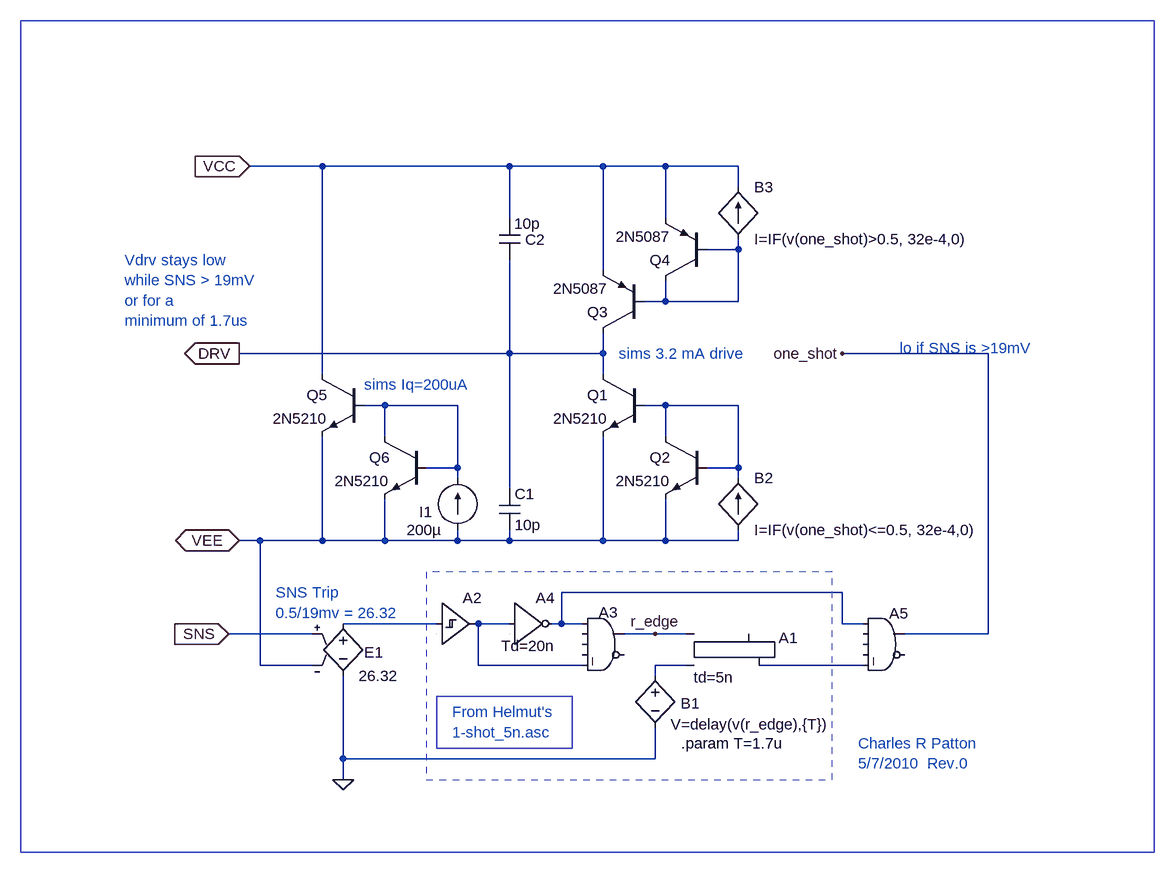
[diagram p0: schematic ZXSC300.asc]
ZXSC300.asc, the LTspice schematic file:
Version 4
SHEET 1 972 740
WIRE -336 -688 -448 -688
WIRE -48 -688 -336 -688
WIRE 96 -688 -48 -688
WIRE 192 -688 96 -688
WIRE 304 -688 192 -688
WIRE 304 -656 304 -688
WIRE -48 -608 -48 -688
WIRE 192 -608 192 -688
WIRE 304 -560 304 -576
WIRE 304 -560 256 -560
WIRE 96 -528 96 -688
WIRE 192 -480 192 -512
WIRE 192 -480 160 -480
WIRE 304 -480 304 -560
WIRE 304 -480 192 -480
WIRE -48 -400 -48 -544
WIRE -48 -400 -464 -400
WIRE 96 -400 96 -432
WIRE 96 -400 -48 -400
WIRE 688 -400 464 -400
WIRE -336 -368 -336 -688
WIRE 96 -368 96 -400
WIRE -240 -320 -272 -320
WIRE -128 -320 -240 -320
WIRE 192 -320 160 -320
WIRE 304 -320 192 -320
WIRE -240 -272 -240 -320
WIRE 192 -272 192 -320
WIRE -128 -224 -128 -320
WIRE -128 -224 -176 -224
WIRE 304 -224 304 -320
WIRE 304 -224 256 -224
WIRE -128 -208 -128 -224
WIRE 304 -208 304 -224
WIRE -48 -192 -48 -400
WIRE -432 -112 -464 -112
WIRE -336 -112 -336 -272
WIRE -336 -112 -432 -112
WIRE -240 -112 -240 -176
WIRE -240 -112 -336 -112
WIRE -128 -112 -128 -128
WIRE -128 -112 -240 -112
WIRE -48 -112 -48 -128
WIRE -48 -112 -128 -112
WIRE 96 -112 96 -272
WIRE 96 -112 -48 -112
WIRE 192 -112 192 -176
WIRE 192 -112 96 -112
WIRE 304 -112 304 -128
WIRE 304 -112 192 -112
WIRE 464 -32 32 -32
WIRE -160 16 -304 16
WIRE -48 16 -96 16
WIRE 32 16 32 -32
WIRE 32 16 16 16
WIRE 64 16 32 16
WIRE 464 16 464 -32
WIRE 496 16 464 16
WIRE -352 32 -480 32
WIRE 176 32 128 32
WIRE 224 32 176 32
WIRE 688 32 688 -400
WIRE 688 32 560 32
WIRE -432 80 -432 -112
WIRE -352 80 -432 80
WIRE -96 80 -96 16
WIRE 64 80 -96 80
WIRE 224 80 176 80
WIRE 496 80 336 80
WIRE 176 96 176 80
WIRE -304 224 -304 96
WIRE 176 224 176 176
WIRE 176 224 -304 224
WIRE -304 256 -304 224
FLAG -480 32 SNS
IOPIN -480 32 In
FLAG 176 32 r_edge
FLAG -464 -400 DRV
IOPIN -464 -400 Out
FLAG 464 -400 one_shot
FLAG -448 -688 VCC
IOPIN -448 -688 In
FLAG -464 -112 VEE
IOPIN -464 -112 BiDir
FLAG -304 256 0
SYMBOL Digital\\srflop 272 -16 R0
WINDOW 123 -37 115 Left 0
SYMATTR Value2 td=5n
SYMATTR InstName A1
SYMBOL bv 176 80 R0
WINDOW 0 39 59 Left 0
WINDOW 3 24 91 Left 0
SYMATTR InstName B1
SYMATTR Value V=delay(v(r_edge),{T})
SYMBOL Digital\\schmtbuf -160 -48 R0
SYMATTR InstName A2
SYMBOL e -304 0 R0
WINDOW 0 32 60 Left 0
SYMATTR InstName E1
SYMATTR Value 26.32
SYMBOL Digital\\and 96 -16 R0
WINDOW 0 -7 15 Left 0
SYMATTR InstName A3
SYMBOL Digital\\inv -48 -48 R0
WINDOW 3 -13 98 Left 0
SYMATTR Value Td=20n
SYMATTR InstName A4
SYMBOL Digital\\and 528 -16 R0
SYMATTR InstName A5
SYMBOL cap -64 -192 R0
SYMATTR InstName C1
SYMATTR Value 10p
SYMBOL bi2 304 -208 R0
SYMATTR Value I=IF(v(one_shot)<=0.5, 32e-4,0)
SYMATTR InstName B2
SYMBOL bi2 304 -656 R0
SYMATTR Value I=IF(v(one_shot)>0.5, 32e-4,0)
SYMATTR InstName B3
SYMBOL cap -64 -608 R0
WINDOW 0 40 33 Left 0
WINDOW 3 23 8 Left 0
SYMATTR InstName C2
SYMATTR Value 10p
SYMBOL npn 160 -368 M0
SYMATTR InstName Q1
SYMATTR Value 2N5210
SYMBOL npn 256 -272 M0
SYMATTR InstName Q2
SYMATTR Value 2N5210
SYMBOL pnp 160 -432 R180
SYMATTR InstName Q3
SYMATTR Value 2N5087
SYMBOL pnp 256 -512 R180
SYMATTR InstName Q4
SYMATTR Value 2N5087
SYMBOL npn -272 -368 M0
SYMATTR InstName Q5
SYMATTR Value 2N5210
SYMBOL npn -176 -272 M0
SYMATTR InstName Q6
SYMATTR Value 2N5210
SYMBOL current -128 -128 R180
WINDOW 0 39 28 Left 0
WINDOW 3 24 0 Left 0
SYMATTR InstName I1
SYMATTR Value 200µ
TEXT -136 152 Left 0 ;From Helmut's \n1-shot_5n.asc
TEXT -640 -544 Left 0 ;Vdrv stays low \nwhile SNS > 19mV \nor for a \nminimum of 1.7us
TEXT 216 200 Left 0 !.param T=1.7u
TEXT -408 -32 Left 0 ;SNS Trip \n0.5/19mv = 26.32
TEXT 488 200 Left 0 ;Charles R Patton\n5/7/2010  Rev.0
TEXT 552 -408 Left 0 ;lo if SNS is >19mV
TEXT -272 -352 Left 0 ;sims Iq=200uA
TEXT 120 -400 Left 0 ;sims 3.2 mA drive
RECTANGLE Normal 48 208 -160 128
RECTANGLE Normal 448 -64 -176 256 2
RECTANGLE Normal 944 368 -800 -912

The netlist it stands for:
* ZXSC300.asc
A1 r_edge N007 0 0 0 N008 0 0 SRFLOP td=5n
B1 N007 0 V=delay(v(r_edge),{T})
A2 N005 0 0 0 0 0 N006 0 SCHMITT
E1 N005 0 SNS VEE 26.32
A3 N004 0 0 0 N006 0 r_edge 0 AND
A4 N006 0 0 0 0 N004 0 0 BUF Td=20n
A5 N004 0 0 0 N008 0 one_shot 0 AND
C1 DRV VEE 10p
B2 VEE N003 I=IF(v(one_shot)<=0.5, 32e-4,0)
B3 N001 VCC I=IF(v(one_shot)>0.5, 32e-4,0)
C2 VCC DRV 10p
Q1 DRV N003 VEE 0 2N5210
Q2 N003 N003 VEE 0 2N5210
Q3 DRV N001 VCC 0 2N5087
Q4 N001 N001 VCC 0 2N5087
Q5 VCC N002 VEE 0 2N5210
Q6 N002 N002 VEE 0 2N5210
I1 VEE N002 200µ
.model NPN NPN
.model PNP PNP
.lib standard.bjt
* From Helmut's
* 1-shot_5n.asc
* Vdrv stays low
* while SNS > 19mV
* or for a
* minimum of 1.7us
.param T=1.7u
* SNS Trip
* 0.5/19mv = 26.32
* Charles R Patton
* 5/7/2010  Rev.0
* lo if SNS is >19mV
* sims Iq=200uA
* sims 3.2 mA drive
.backanno
.end